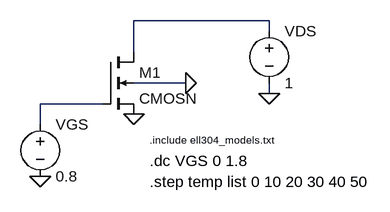
[diagram p0: schematic exmp3.asc]
exmp3.asc, the LTspice schematic file:
Version 4
SHEET 1 880 680
WIRE 512 16 304 16
WIRE 512 32 512 16
WIRE 304 64 304 16
WIRE 384 112 304 112
WIRE 512 128 512 112
WIRE 256 144 160 144
WIRE 160 176 160 144
FLAG 512 128 0
FLAG 160 256 0
FLAG 384 112 0
FLAG 304 160 0
SYMBOL nmos4 256 64 R0
SYMATTR InstName M1
SYMATTR Value CMOSN
SYMATTR Value2 l=0.18u w=5u
SYMBOL voltage 512 16 R0
WINDOW 123 0 0 Left 0
WINDOW 39 0 0 Left 0
SYMATTR InstName VDS
SYMATTR Value 1
SYMBOL voltage 160 160 R0
SYMATTR InstName VGS
SYMATTR Value 0.8
TEXT 328 200 Left 1 !.include ell304_models.txt
TEXT 328 232 Left 2 !.dc VGS 0 1.8
TEXT 328 264 Left 2 !.step temp list 0 10 20 30 40 50

The netlist it stands for:
* exmp3.asc
M1 N001 N002 0 0 CMOSN l=0.18u w=5u
VDS N001 0 1
VGS N002 0 0.8
.model NMOS NMOS
.model PMOS PMOS
.lib standard.mos
.include ell304_models.txt
.dc VGS 0 1.8
.step temp list 0 10 20 30 40 50
.backanno
.end